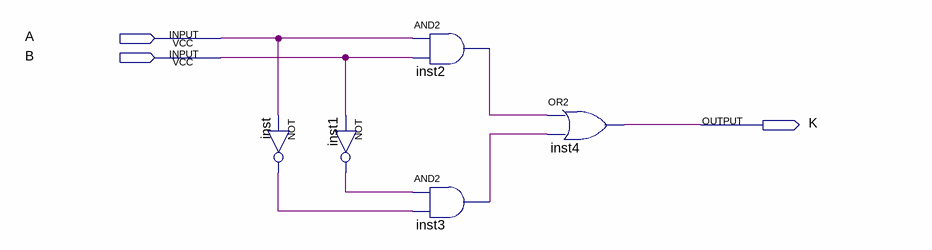
[diagram p0: schematic sheet]
// Quartus schematic Three-Chip-Logic-Circuit.bdf as structural Verilog: 5 symbols, 3 pins
module \Three-Chip-Logic-Circuit  (
  input  A,
  input  B,
  output K
);

  wire inst1_out, inst2_out, inst3_out, inst_out;

  not inst (inst_out, A);
  not inst1 (inst1_out, B);
  and inst2 (inst2_out, A, B);
  and inst3 (inst3_out, inst1_out, inst_out);
  or inst4 (K, inst2_out, inst3_out);
endmodule
